# EAGLE design MiniBot1 (EAGLE 9.1.3)
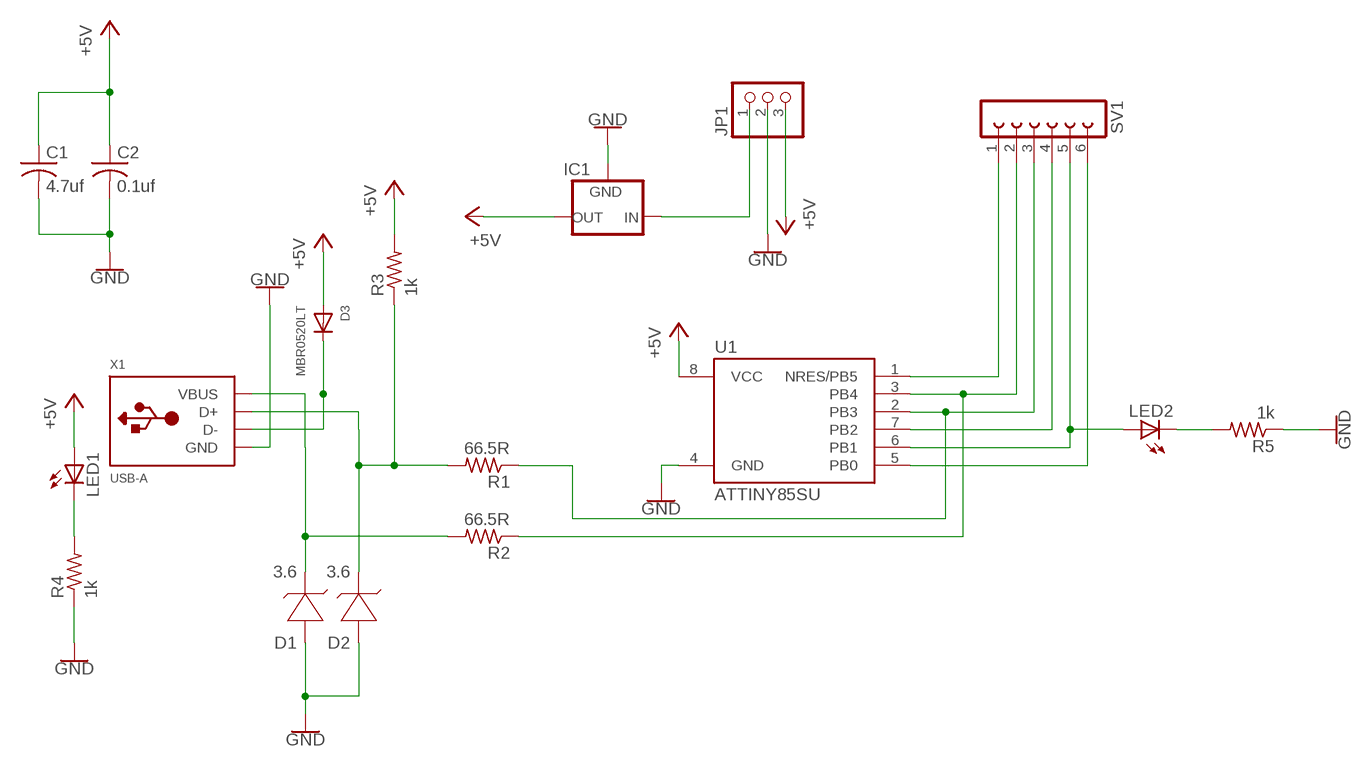
[diagram p0: schematic, sheet 1]

## Parts
C1  4.7uf  C-USC0402  [C0402]
C2  0.1uf  C-USC0402  [C0402]
D1  3.6  ZENER  [SOD123]
D2  3.6  ZENER  [SOD123]
D3  MBR0520LT  DIODESOD-523  [SOD-523]
IC1  MCP1700INLINE  [TO92-INLINE]
JP1  PINHD-1X3  [1X03]
LED1  LED  [SMARTLED-TTW]
LED2  LED  [SMARTLED-TTW]
R1  66.5R  R-US_M0805  [M0805]
R2  66.5R  R-US_M0805  [M0805]
R3  1k  R-US_M0805  [M0805]
R4  1k  R-US_M0805  [M0805]
R5  1k  R-US_M0805  [M0805]
SV1  FE06-1  [FE06]
U1  ATTINY85SU  [ATTINY85]
X1  USB-A  [MOLEX_480371000]

## Nets
+5V: C1.1 C2.1 D3.A IC1.3(OUT) JP1.3 LED1.A@1(A) R3.2 U1.8(VCC)
GND: C1.2 C2.2 D1.A(+) D2.A(+) IC1.1(GND) JP1.2 R4.1 R5.1 U1.4(GND) X1.4(GND)
N$1: SV1.1 U1.1(NRES/PB5)
N$2: R2.1 SV1.2 U1.3(PB4)
N$3: R1.1 SV1.3 U1.2(PB3)
N$4: SV1.4 U1.7(PB2)
N$5: LED2.A@1(A) SV1.5 U1.6(PB1)
N$6: SV1.6 U1.5(PB0)
N$7: D2.C(-) R1.2 R3.1 X1.3(D+)
N$8: D1.C(-) R2.2 X1.1(VBUS)
N$9: D3.K(C) X1.2(D-)
N$10: IC1.2(IN) JP1.1
N$11: LED1.C@1(C) R4.2
N$12: LED2.C@1(C) R5.2

## Library data of the parts
C1 C2 = adafruit:C-US: CAPACITOR, American symbol
D1 D2 = sym:ZENER: Zener Diode
D3 = adafruit:DIODE: Diode SMADIODE - SMA Surface Mount Package 20V 1A Schottky Diode Digikey: 641-1014-6-ND DO-1N4148 - Through Hole Small Current Diode SOD-123 20V 1 A (.5mV Vf) Schottky Diode - Digikey: MBRX120TPMSCT-ND SOD-323 10V 570mA (.38mV Vf, 3ns) Schottky Diode - Digikey: ZLLS410CT-ND SOD-523 30V 30mA Schottky Diode (RB751S-40TE61) - Digikey: RB751S-40TE61CT-ND SOT23-R/W - SOT23 Package (R = Solder Paste/Reflow Ovens, W = Hand-Soldering) BAT54Film 40V 300mA - Digikey: 497-7162-1-ND
IC1 = adafruit:MCP1700: VOLTAGE REGULATOR
JP1 = adafruit:PINHD-1X3: PIN HEADER
LED1 LED2 = adafruit:LED: LED OSRAM: - CHIPLED LG R971, LG N971, LY N971, LG Q971, LY Q971, LO R971, LY R971 LH N974, LH R974 LS Q976, LO Q976, LY Q976 LO Q996 - Hyper CHIPLED LW Q18S LB Q993, LB Q99A, LB R99A - SideLED LS A670, LO A670, LY A670, LG A670, LP A670 LB A673, LV A673, LT A673, LW A673 LH A674 LY A675 LS A676, LA A676, LO A676, LY A676, LW A676 LS A679, LY A679, LG A679 - Hyper Micro SIDELED® LS Y876, LA Y876, LO Y876, LY Y876 LT Y87S - SmartLED LW L88C, LW L88S LB L89C, LB L89S, LG L890 LS L89K, LO L89K, LY L89K LS L896, LA L896, LO L896, LY L896 - TOPLED LS T670, LO T670, LY T670, LG T670, LP T670 LSG T670, LSP T670, LSY T670, LOP T670, LYG T670 LG T671, LOG T671, LSG T671 LB T673, LV T673, LT T673, LW T673 LH T674 LS T676, LA T676, LO T676, LY T676, LB T676, LH T676, LSB T676, LW T676 LB T67C, LV T67C, LT T67C, LS T67K, LO T67K, LY T67K, LW E67C LS E67B, LA E67B, LO E67B, LY E67B, LB E67C, LV E67C, LT E67C LW T67C LS T679, LY T679, LG T679 LS T770, LO T770, LY T770, LG T770, LP T770 LB T773, LV T773, LT T773, LW T773 LH T774 LS E675, LA E675, LY E675, LS T675 LS T776, LA T776, LO T776, LY T776, LB T776 LHGB T686 LT T68C, LB T68C - Hyper Mini TOPLED® LB M676 - Mini TOPLED Santana® LG M470 LS M47K, LO M47K, LY M47K Source: http://www.osram.convergy.de/
R1-R5 = adafruit:R-US_: RESISTOR, American symbol
SV1 = con-lsta:FE06-1: FEMALE HEADER; OC_FARNELL: unknown; OC_NEWARK: unknown
U1 = ATTiny85:ATTINY85: ATMEL ATtiny 85
X1 = adafruit:USB-A: USB type A 'plug' Used for things that can directly connect to a USB port, say USB key

## Board
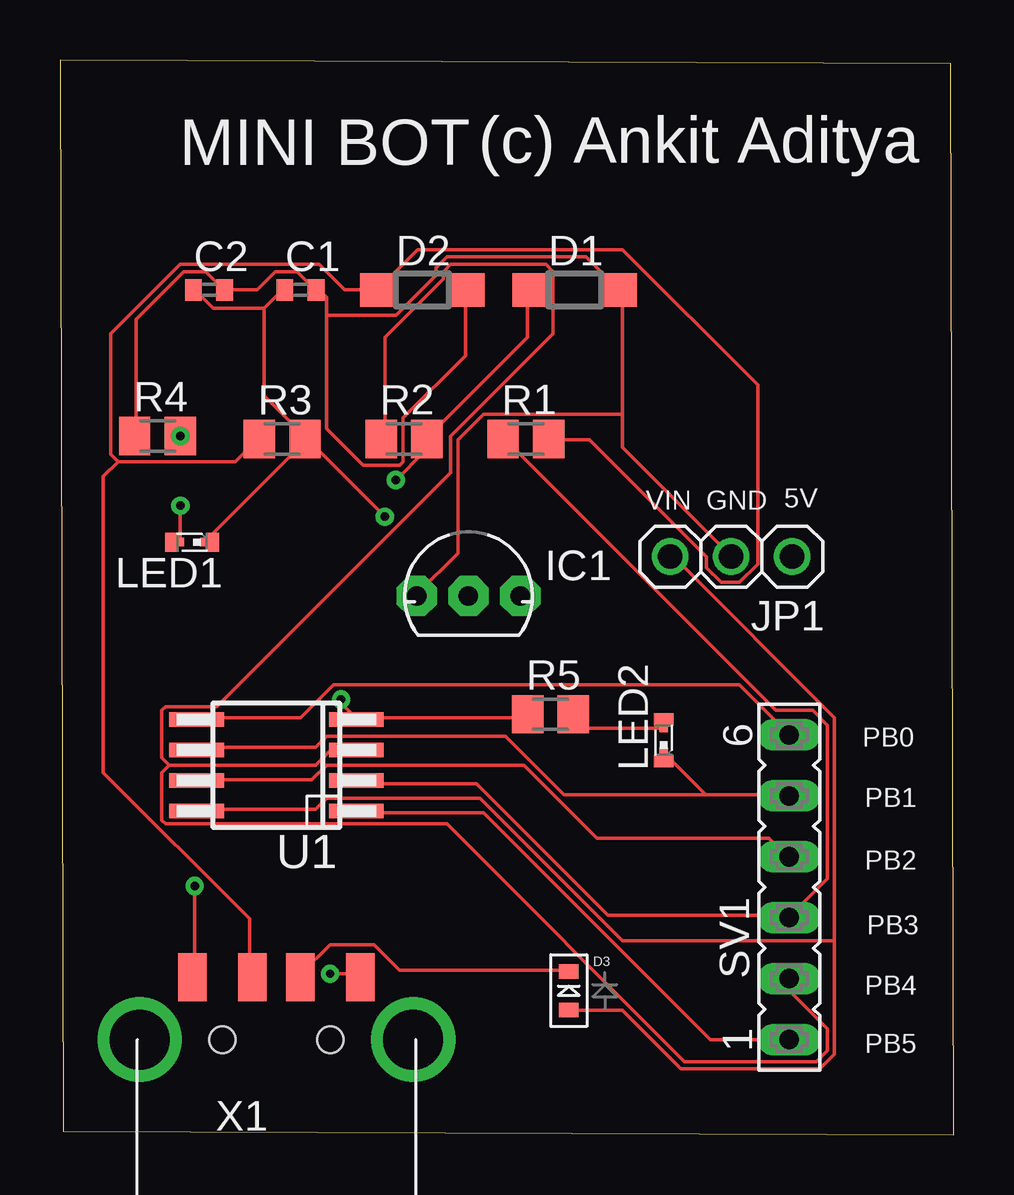
[diagram p1: board, top side]
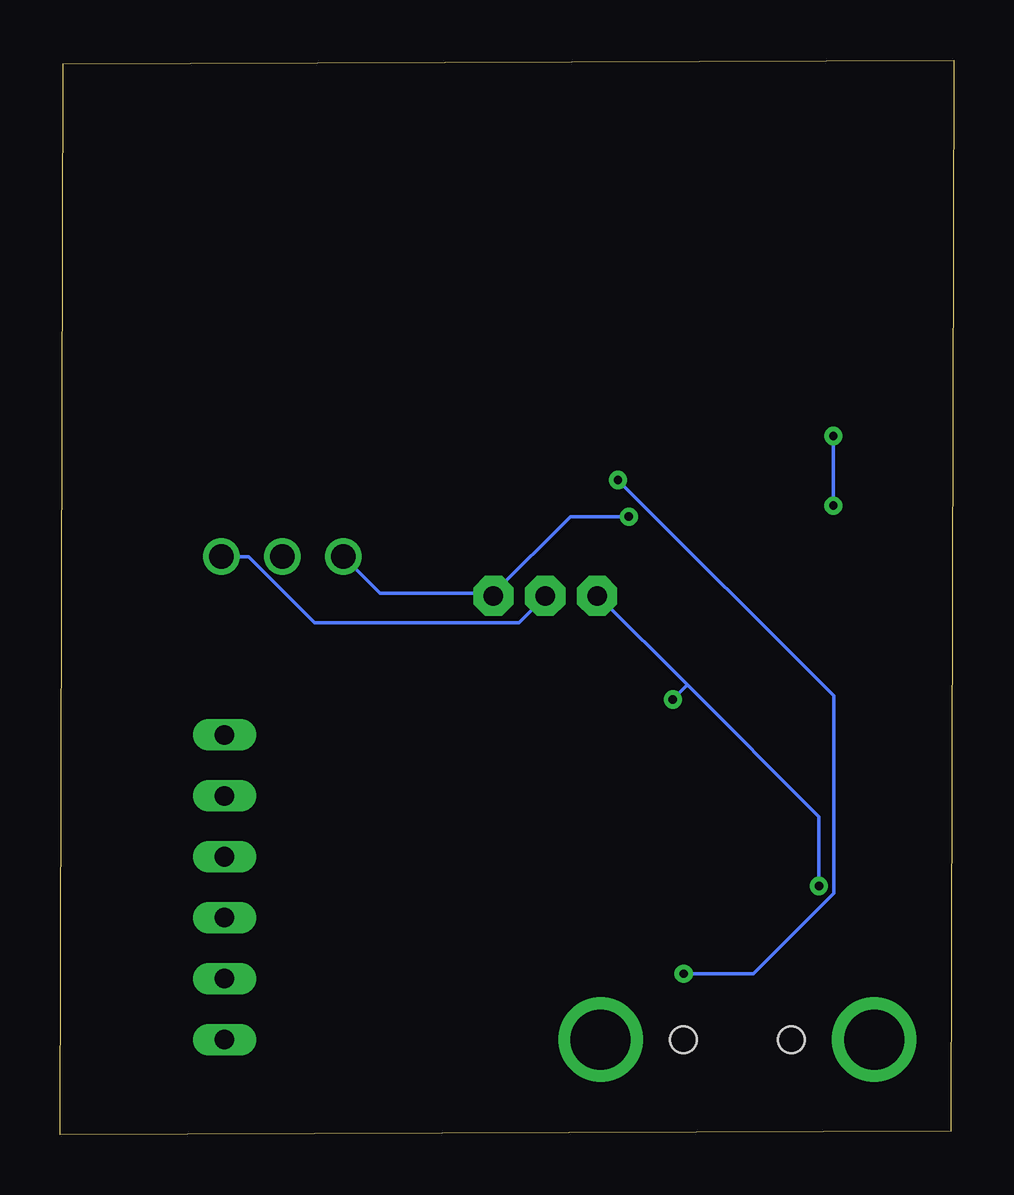
[diagram p2: board, bottom side, seen from below]

Size 37.26 x 44.77 mm. Coordinates in mm from the lower left corner, seen from the top.
Outline: 0.13,0.15 37.26,0 37.13,44.63 0,44.77 0.13,0.15
Copper layers (1*16): Top 0.035mm / dielectric 1.5mm / Bottom 0.035mm
Design rules "default": minimum track width 6mil, minimum drill 0.35mm, track to track 6mil, track to pad 6mil, pad to pad 6mil, via to via 6mil, smd to smd 6mil, copper to edge 40mil, drill to drill 6mil, minimum pad ring 10mil, minimum via ring 8mil, stop-mask expansion 4mil, vias tented up to drill 0mil, thermal gap 10mil

### Footprints (pad centres in the part's own frame; a part is rotated, then mirrored left to right if it is on the bottom)
C0402 = smd 0.7 x 0.9: 1 -0.65,0; 2 0.65,0
SOD123 = smd 1.4 x 1.4: A 1.9,0; C -1.9,0
SOD-523 = smd 0.8 x 0.6: A 0,-0.8; K 0,0.8
TO92-INLINE = drill 0.813 pad 1.676 octagon: 1 -2.159,0; 2 0,0; 3 2.159,0
1X03 = drill 1.016: 1 -2.54,0; 2 0,0; 3 2.54,0
SMARTLED-TTW = smd 0.8 x 0.5: A 0,-0.875; C 0,0.875 | smd 0.35 x 0.35: A@1 0,-0.5; C@1 0,0.5
M0805 = smd 1.3 x 1.6: 1 -0.95,0; 2 0.95,0
FE06 = drill 0.813 long: 1 -6.35,0; 2 -3.81,0; 3 -1.27,0; 4 1.27,0; 5 3.81,0; 6 6.35,0
ATTINY85 = smd 0.6 x 2.286: 1 -1.905,-3.33; 2 -0.635,-3.33; 3 0.635,-3.33; 4 1.905,-3.33; 5 1.905,3.33; 6 0.635,3.33; 7 -0.635,3.33; 8 -1.905,3.33
MOLEX_480371000 = smd 1.2 x 2: 1 3.5,2.6; 2 1,2.6; 3 -1,2.6; 4 -3.5,2.6 | drill 2.5: M1 -5.7,0; M2 5.7,0 | hole 1.1: -2.25,0; 2.25,0

### Placement (x,y rotation side)
C1  10.03,35.2 0 top
C2  6.22,35.2 0 top
D1  21.46,35.2 0 top
D2  15.11,35.2 0 top
D3  21.21,5.99 0 top
IC1  17.03,22.45 0 top
JP1  27.98,24.09 180 top
LED1  5.51,24.68 90 top
LED2  25.17,16.43 0 top
R1  19.42,28.98 0 top
R2  14.34,28.98 0 top
R3  9.26,28.98 0 top
R4  4.07,29.11 0 top
R5  20.45,17.51 0 top
SV1  30.4,10.31 90 top
U1  9.02,15.39 90 top
X1  9.02,3.96 0 top

### Tracks (layer width: path | path; a pad name or v marks a point on that pad's centre or on a via)
+5V  (via drill 0.35)
  Top 0.152: 8.52,34.44 6.38,34.44 5.62,35.2 C2.1 | 8.52,34.44 9.28,35.2 C1.1 | 10.19,28.95 R3.2 | 8.52,34.44 8.52,30.78 10.19,29.1 R3.2 | 32.29,8.07 32.29,17.37 25.58,24.07 JP1.3 | 32.29,8.07 32.29,3.35 31.68,2.74 25.89,2.74 23.45,5.18 21.32,5.18 D3.A | 32.29,8.07 23.45,8.07 17.51,14.01 11.11,14.01 10.65,13.56 5.77,13.56 U1.8 | 10.34,28.95 R3.2 | v13.54,25.75 10.34,28.95 | LED1.A@1 10.28,28.95 10.34,28.95
  Bottom 0.152: JP1.3 23.91,22.55 19.34,22.55 IC1.3 19.18,22.55 15.98,25.75 v13.54,25.75
GND  (via drill 0.35)
  Top 0.152: 11.11,34.13 11.11,34.89 10.8,35.2 C1.2 10.65,35.2 9.89,35.96 8.97,35.96 8.21,35.2 C2.2 6.84,35.2 6.08,35.96 5.16,35.96 3.18,33.98 3.18,29.25 R4.1 | 11.11,34.13 11.11,29.41 12.63,27.88 14.15,27.88 14.31,28.04 14.31,29.86 16.9,32.46 16.9,35.2 D2.A | 23.45,30.02 23.45,28.65 27.87,24.23 JP1.2 | 23.45,30.02 23.45,35.2 D1.A 23.3,35.2 21.93,36.57 16.14,36.57 15.68,36.11 15.68,35.81 14,34.13 11.11,34.13 | R5.1 19.49,17.37 12.48,17.37 U1.4 12.33,17.37 11.72,17.98 v11.72,18.13 | v5.62,10.36 5.62,6.7 X1.4 | 23.45,30.02 17.66,30.02 16.59,28.95 16.59,24.23 14.92,22.55 IC1.1
  Bottom 0.152: v5.62,10.36 5.62,13.25 11.11,18.74 | 11.11,18.74 14.76,22.4 IC1.1 | 11.11,18.74 v11.72,18.13
N$1
  Top 0.152: SV1.1 27.11,3.96 17.66,13.41 12.48,13.41 U1.1
N$2
  Top 0.152: 4.55,15.39 4.25,15.69 4.25,17.67 4.4,17.82 6.53,17.82 16.29,27.58 16.29,29.1 20.56,33.37 20.56,35.96 20.25,36.27 16.29,36.27 15.98,35.96 15.98,35.66 13.54,33.22 13.54,29.1 R2.1 | 4.55,15.39 10.65,15.39 11.26,16 12.33,16 U1.3 | 4.55,15.39 4.25,15.08 4.25,13.1 4.4,12.95 16.14,12.95 26.04,3.04 31.53,3.04 31.99,3.5 31.99,4.41 30.46,5.94 30.46,6.39 SV1.2
N$3
  Top 0.152: R1.1 18.57,28.95 29.85,17.67 31.38,17.67 31.99,17.06 31.99,10.66 30.46,9.14 SV1.3 30.31,9.14 22.84,9.14 17.35,14.62 12.48,14.62 U1.2
N$4
  Top 0.152: U1.7 5.77,14.78 10.5,14.78 11.11,15.39 19.34,15.39 22.38,12.34 29.55,12.34 30.31,11.58 SV1.4
N$5
  Top 0.152: 26.93,14.17 21.01,14.17 18.57,16.61 11.11,16.61 10.65,16.15 5.77,16.15 U1.6 | SV1.5 30.31,14.17 26.93,14.17 | LED2.A@1 26.93,14.17
N$6
  Top 0.152: U1.5 5.77,17.37 10.04,17.37 11.41,18.74 28.33,18.74 30.31,16.76 SV1.6
N$7
  Top 0.152: 2.42,28.04 2.11,28.34 2.11,33.37 5.01,36.27 10.8,36.27 11.87,35.2 D2.C 13.24,35.2 14.92,36.87 23.45,36.87 29.09,31.24 29.09,23.77 28.33,23.01 27.57,23.01 26.96,23.62 26.96,24.07 22.08,28.95 20.4,28.95 R1.2 | 2.42,28.04 7.3,28.04 8.21,28.95 R3.1 | 2.42,28.04 1.81,27.43 1.81,15.08 7.91,8.99 7.91,6.7 X1.3
N$8  (via drill 0.35)
  Top 0.152: D1.C 19.49,35.2 19.49,33.22 15.37,29.1 R2.2 15.22,28.95 15.22,28.49 v14,27.27 | v11.26,6.7 12.48,6.7 X1.1
  Bottom 0.152: v11.26,6.7 8.36,6.7 5.01,10.05 5.01,18.28 v14,27.27
N$9
  Top 0.152: D3.K 21.16,6.85 14.15,6.85 13.09,7.92 11.26,7.92 10.04,6.7 X1.2
N$10
  Bottom 0.152: JP1.1 30.46,24.07 29.39,24.07 26.65,21.33 18.12,21.33 17.05,22.4 IC1.2
N$11  (via drill 0.35)
  Top 0.152: LED1.C@1 5.01,26.2 v5.02,26.21
  Bottom 0.152: v5.02,26.21 R4.2
  other vias: 5.02,29.11
N$12
  Top 0.152: LED2.C@1 21.98,16.93 R5.2

### Text on the board
tNames: MINI BOT | (c) Ankit Aditya | VIN | GND | 5V | PB0 | PB1 | PB2 | PB3 | PB4 | PB5